# EAGLE design nRF51x22_qfaa (EAGLE 7.6.0)
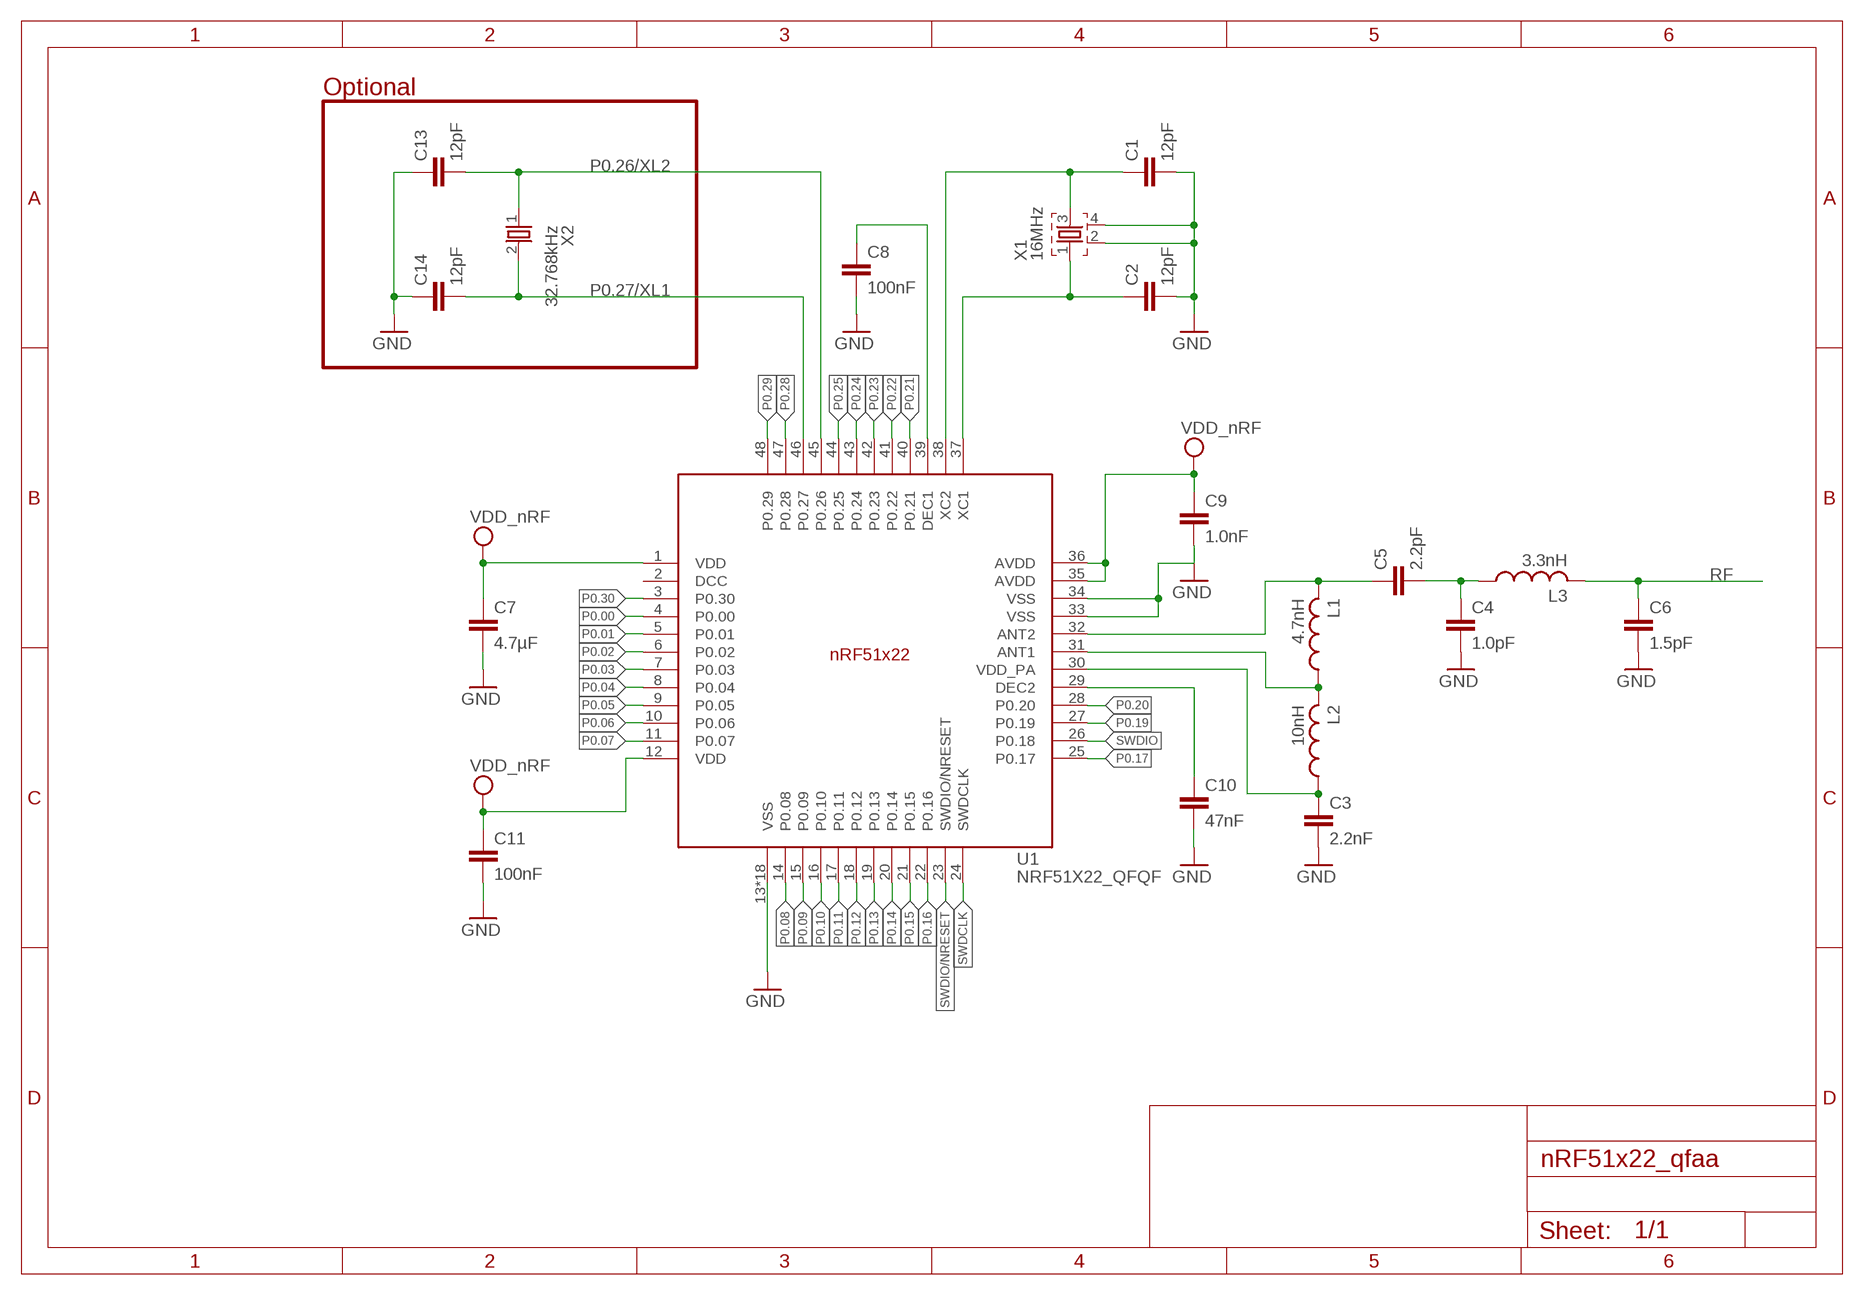
[diagram p0: schematic, sheet 1]

## Parts
C1  12pF  CAPACITOR_0402_N  [RESC0402_N]
C2  12pF  CAPACITOR_0402_N  [RESC0402_N]
C3  2.2nF  CAPACITOR_0402_N  [RESC0402_N]
C4  1.0pF  CAPACITOR_0402_N  [RESC0402_N]
C5  2.2pF  CAPACITOR_0402_N  [RESC0402_N]
C6  1.5pF  CAPACITOR_0402_N  [RESC0402_N]
C7  4.7µF  CAPACITOR_0603_N  [RESC0603_N]
C8  100nF  CAPACITOR_0402_N  [RESC0402_N]
C9  1.0nF  CAPACITOR_0402_N  [RESC0402_N]
C10  47nF  CAPACITOR_0402_N  [RESC0402_N]
C11  100nF  CAPACITOR_0402_N  [RESC0402_N]
C13  12pF  CAPACITOR_0402_N  [RESC0402_N]
C14  12pF  CAPACITOR_0402_N  [RESC0402_N]
L1  4.7nH  INDUCTOR_0402_N  [RESC0402_N]
L2  10nH  INDUCTOR_0402_N  [RESC0402_N]
L3  3.3nH  INDUCTOR_0402_N  [RESC0402_N]
U1  NRF51X22_QFQF  [QFN40P600X600X90-48_N]
X1  16MHz  XTAL_32MHZ  [BT-XTAL_2016_N]
X2  32.768kHz  XTAL_32KHZ  [XTAL_3215_N]

## Nets
GND: C1.2 C2.2 C3.2 C4.2 C6.2 C7.2 C8.2 C9.2 C10.2 C11.2 C13.1 C14.1 U1.13(VSS) U1.33(VSS) U1.34(VSS) U1.PAD(VSS) U1.PAD@VIA01(VSS) U1.PAD@VIA02(VSS) U1.PAD@VIA03(VSS) U1.PAD@VIA04(VSS) U1.PAD@VIA05(VSS) U1.PAD@VIA06(VSS) U1.PAD@VIA07(VSS) U1.PAD@VIA08(VSS) U1.PAD@VIA09(VSS) U1.PAD@VIA10(VSS) U1.PAD@VIA11(VSS) U1.PAD@VIA12(VSS) U1.PAD@VIA13(VSS) U1.PAD@VIA14(VSS) U1.PAD@VIA15(VSS) U1.PAD@VIA16(VSS) X1.2 X1.4
N$1: L1.1 L2.2 U1.31(ANT1)
N$3: C1.1 U1.38(XC2) X1.3
N$5: C10.1 U1.29(DEC2)
N$6: C8.1 U1.39(DEC1)
N$7: C3.1 L2.1 U1.30(VDD_PA)
N$9: C5.1 L1.2 U1.32(ANT2)
N$10: C4.1 C5.2 L3.1
P0.00: U1.4(P0.00)
P0.01: U1.5(P0.01)
P0.02: U1.6(P0.02)
P0.03: U1.7(P0.03)
P0.04: U1.8(P0.04)
P0.05: U1.9(P0.05)
P0.06: U1.10(P0.06)
P0.07: U1.11(P0.07)
P0.08: U1.14(P0.08)
P0.09: U1.15(P0.09)
P0.10: U1.16(P0.10)
P0.11: U1.17(P0.11)
P0.12: U1.18(P0.12)
P0.13: U1.19(P0.13)
P0.14: U1.20(P0.14)
P0.15: U1.21(P0.15)
P0.16: U1.22(P0.16)
P0.17: U1.25(P0.17)
P0.19: U1.27(P0.19)
P0.20: U1.28(P0.20)
P0.21: U1.40(P0.21)
P0.22: U1.41(P0.22)
P0.23: U1.42(P0.23)
P0.24: U1.43(P0.24)
P0.25: U1.44(P0.25)
P0.26/XL2: C13.2 U1.45(P0.26) X2.1
P0.27/XL1: C14.2 U1.46(P0.27) X2.2
P0.28: U1.47(P0.28)
P0.29: U1.48(P0.29)
P0.30: U1.3(P0.30)
RF: C6.1 L3.2
SWDCLK: U1.24(SWDCLK)
SWDIO: U1.26(P0.18)
SWDIO/NRESET: U1.23(SWDIO/NRESET)
VDD_NRF: C7.1 C9.1 C11.1 U1.1(VDD) U1.12(VDD) U1.35(AVDD) U1.36(AVDD) ; supply symbol labelled VDD_nRF
X1: C2.1 U1.37(XC1) X1.1

## Notes on the sheet
- Optional

## Power pins joined to a net without a drawn wire
DCC: U1.2(DCC)

## Library data of the parts
C1-C11 C13 C14 = Nordic_nRF:CAPACITOR: Generic chip capacitor
L1-L3 = Nordic_nRF:INDUCTOR: Generic chip inductor
U1 = Nordic_nRF:NRF51X22_QF: nRF51x22 For devices: nRF51422 nRF51822 Features Single chip, highly flexible, 2.4 GHz multi-protocol device 32-bit ARM Cortex M0 CPU core 256kB/128kB flash + 32kB/16kB RAM Supports Bluetooth low energy protocol stacks Thread safe and run-time protected Event driven API On air compatible with nRF24L series 3 data rates (2Mbps/1Mbps/250kbps) +4dBm output power -93dBm sensitivity, Bluetooth low energy PPI system for maximum power-efficient applications and code simplification Flexible power management system with automatic power management of each peripheral Configurable I/O mapping for analog and digital I/O Applications Mobile phone accessories Wearables Beacons Rezence wireless charging monitoring PC peripherals Consumer Electronics (CE) remote controls Proximity/Alert sensors Smart Home Sports, fitness and healthcare sensors Smart RF tags Toys and electronic games Intelligent domestic appliances Industrial and commercial sensors Lighting
X1 = Nordic_nRF:XTAL_32MHZ
X2 = Nordic_nRF:XTAL_32KHZ

## Board
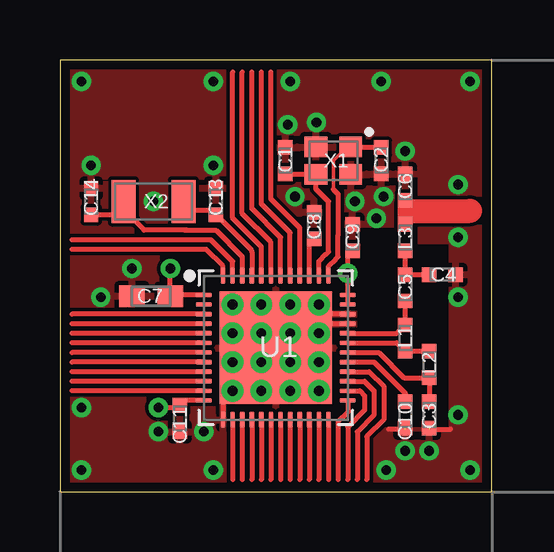
[diagram p1: board, top side]
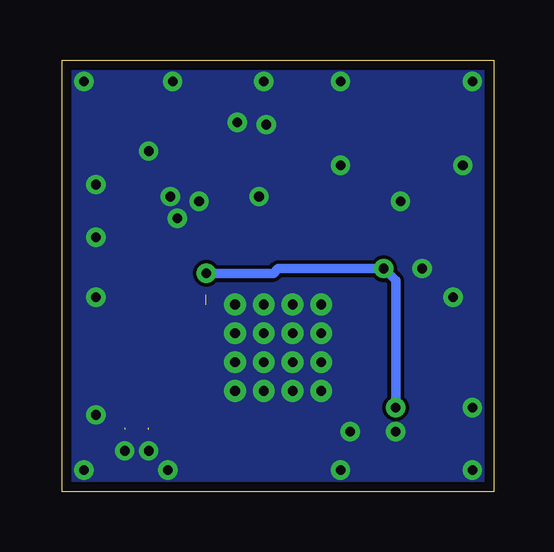
[diagram p2: board, bottom side, seen from below]

Size 18 x 18 mm. Coordinates in mm from the lower left corner, seen from the top.
Outline: 0,0 18,0 18,18 0,18 0,0
Copper layers (1*16): Top 0.035mm / dielectric 1.5mm / Bottom 0.035mm
Design rules "Nordic": minimum track width 0.15mm, minimum drill 0.4mm, track to track 0.15mm, track to pad 0.15mm, pad to pad 0.15mm, via to via 0.15mm, smd to smd 0.15mm, copper to edge 0.4mm, drill to drill 0.4mm, minimum pad ring 10mil, minimum via ring 8mil, stop-mask expansion 4mil, vias tented up to drill 0mil, thermal gap 0.2mm
tRestrict: area 12.4,2.7 to 16.2,10.3; area 11.8,7.2 to 12.2,7.2; area 12.5,10.3 to 14.1,11; area 14.7,12.2 to 14.9,13.1; area 14.7,10.3 to 14.9,11.1

### Footprints (pad centres in the part's own frame; a part is rotated, then mirrored left to right if it is on the bottom)
RESC0402_N = smd 0.6 x 0.6: 1 -0.55,0; 2 0.55,0
RESC0603_N = smd 1.05 x 0.9: 1 -0.8,0; 2 0.8,0
QFN40P600X600X90-48_N = smd 0.65 x 0.2: 1 -3,2.2; 2 -3,1.8; 3 -3,1.4; 4 -3,1; 5 -3,0.6; 6 -3,0.2; 7 -3,-0.2; 8 -3,-0.6; 9 -3,-1; 10 -3,-1.4; 11 -3,-1.8; 12 -3,-2.2; 25 3,-2.2; 26 3,-1.8; 27 3,-1.4; 28 3,-1; 29 3,-0.6; 30 3,-0.2; 31 3,0.2; 32 3,0.6; 33 3,1; 34 3,1.4; 35 3,1.8; 36 3,2.2 | smd 0.2 x 0.65: 13 -2.2,-3; 14 -1.8,-3; 15 -1.4,-3; 16 -1,-3; 17 -0.6,-3; 18 -0.2,-3; 19 0.2,-3; 20 0.6,-3; 21 1,-3; 22 1.4,-3; 23 1.8,-3; 24 2.2,-3; 37 2.2,3; 38 1.8,3; 39 1.4,3; 40 1,3; 41 0.6,3; 42 0.2,3; 43 -0.2,3; 44 -0.6,3; 45 -1,3; 46 -1.4,3; 47 -1.8,3; 48 -2.2,3 | smd 4.7 x 4.7: PAD 0,0 | drill 0.4: PAD@VIA01 -1.8,1.8; PAD@VIA02 -1.8,0.6; PAD@VIA03 -1.8,-0.6; PAD@VIA04 -1.8,-1.8; PAD@VIA05 -0.6,1.8; PAD@VIA06 -0.6,0.6; PAD@VIA07 -0.6,-0.6; PAD@VIA08 -0.6,-1.8; PAD@VIA09 0.6,1.8; PAD@VIA10 0.6,0.6; PAD@VIA11 0.6,-0.6; PAD@VIA12 0.6,-1.8; PAD@VIA13 1.8,1.8; PAD@VIA14 1.8,0.6; PAD@VIA15 1.8,-0.6; PAD@VIA16 1.8,-1.8
BT-XTAL_2016_N = smd 0.95 x 0.85: 1 -0.725,-0.575; 2 0.725,-0.575; 3 0.725,0.575; 4 -0.725,0.575
XTAL_3215_N = smd 1 x 1.8: 1 -1.25,0; 2 1.25,0

### Placement (x,y rotation side)
C1  9.4,13.8 90 top
C2  13.4,13.8 270 top
C3  15.4,3.2 270 top
C4  15.95,9.05 0 top
C5  14.4,8.5 90 top
C6  14.4,12.7 90 top
C7  3.8,8.15 180 top
C8  10.6,11.1 90 top
C9  12.2,10.6 90 top
C10  14.4,3.2 270 top
C11  5,3.05 270 top
C13  6.5,12.1 270 top
C14  1.3,12.1 270 top
L1  14.4,6.4 90 top
L2  15.4,5.3 90 top
L3  14.4,10.6 90 top
U1  9,6 0 top
X1  11.4,13.8 180 top
X2  3.9,12.1 180 top

### Tracks (layer width: path | path; a pad name or v marks a point on that pad's centre or on a via)
GND  (via drill 0.4 pad 0.8)  (2 unrouted)
  Top 0.2: U1.PAD@VIA04 6.8,4.2 U1.13 | U1.34 10.8,7.4 U1.PAD@VIA13 | U1.33 11.2,7 U1.PAD@VIA14 | U1.PAD@VIA04 U1.PAD@VIA16 U1.PAD@VIA13 | U1.PAD@VIA04 U1.PAD@VIA01 U1.PAD@VIA13 | U1.PAD@VIA06 9,6.6 U1.PAD | 14.4,2.6 13.7,2.6 | 15.4,2.6 16.3,2.6
  other vias: 13.5,12.3 12.3,12.1 9.8,12.3 14.4,14.2 16.6,12.8 16.6,10.6 10.7,15.4 9.5,15.3 6.4,13.6 1.3,13.6 6,2.5 4.1,2.5 14.4,1.7 15.4,1.7 16.6,8.1 16.6,3.2 6.4,0.9 0.9,0.9 0.9,3.5 3.9,12.1 9.6,17.1 13.4,17.1 17.1,17.1 17.1,0.9 13.6,0.9 13.2,11.4 0.9,17.1 6.4,17.1 1.7,8.1 3,9.3
  pour Top: 0,0 0,18 18,18 18,0
  pour Bottom: 0,0 0,18 18,18 18,0
  cutout Top: 6.8,3.8 6.8,8.2 11.2,8.2 11.2,3.8
N$1
  Top 0.2: U1.31 14.05,6.2 L1.1 L2.2
N$3
  Top 0.2: U1.38 10.8,9.6 11.1,9.9 11.2,10 11.2,12.1 10.68,12.62 X1.3 10.65,13.25 C1.1
N$5
  Top 0.2: U1.29 13.1,5.4 14.4,4.1 C10.1
N$6
  Top 0.2: U1.39 10.4,10.35 C8.1
N$7
  Top 0.2: C3.1 L2.1 14.35,4.75 13.3,5.8 13,5.8 U1.30
N$9
  Top 0.2: U1.32 14.05,6.6 L1.2 C5.1
N$10
  Top 0.2: C4.1 C5.2 L3.1
P0.00
  Top 0.2: U1.4 0.5,7
P0.01
  Top 0.2: U1.5 0.5,6.6
P0.02
  Top 0.2: U1.6 0.5,6.2
P0.03
  Top 0.2: U1.7 0.5,5.8
P0.04
  Top 0.2: U1.8 0.5,5.4
P0.05
  Top 0.2: U1.9 0.5,5
P0.06
  Top 0.2: U1.10 0.5,4.6
P0.07
  Top 0.2: U1.11 0.5,4.2
P0.08
  Top 0.2: U1.14 7.2,0.5
P0.09
  Top 0.2: U1.15 7.6,0.5
P0.10
  Top 0.2: U1.16 8,0.5
P0.11
  Top 0.2: U1.17 8.4,0.5
P0.12
  Top 0.2: U1.18 8.8,0.5
P0.13
  Top 0.2: U1.19 9.2,0.5
P0.14
  Top 0.2: U1.20 9.6,0.5
P0.15
  Top 0.2: U1.21 10,0.5
P0.16
  Top 0.2: U1.22 10.4,0.5
P0.17
  Top 0.2: U1.25 12,3.3 11.6,2.9 11.6,0.5
P0.19
  Top 0.2: U1.27 12.7,4.6 13.1,4.2 13.1,3.2 12.4,2.5 12.4,0.5
P0.20
  Top 0.2: U1.28 12.9,5 13.5,4.4 13.5,3 12.8,2.3 12.8,0.5
P0.21
  Top 0.2: U1.40 10,11 8.8,12.2 8.8,17.5
P0.22
  Top 0.2: U1.41 9.6,10.8 8.4,12 8.4,17.5
P0.23
  Top 0.2: U1.42 9.2,10.6 8,11.8 8,17.5
P0.24
  Top 0.2: U1.43 8.8,10.4 7.6,11.6 7.6,17.5
P0.25
  Top 0.2: U1.44 8.4,10.2 7.2,11.4 7.2,17.5
P0.26/XL2
  Top 0.2: X2.1 5.5,11.75 | 5.5,11.75 5.5,11.4 | 5.5,11.75 6.3,11.75 arc-90 C13.2 8,10.05 8,10 U1.45
P0.27/XL1
  Top 0.2: 2.65,11.75 3.5,10.9 5.2,10.9 5.3,10.9 6.5,10.9 7.6,9.8 U1.46 | 2.65,11.75 X2.2 2.65,11.75 | C14.2 2.65,11.55 2.65,11.75
P0.28
  Top 0.2: U1.47 7.2,9.6 6.3,10.5 0.5,10.5
P0.29
  Top 0.2: U1.48 6.8,9.4 6.1,10.1 0.5,10.1
P0.30
  Top 0.2: U1.3 0.5,7.4
RF
  Top 0.2: C6.1 14.6,11.7 L3.2 14.25,11.15 14.2,11.2 14.2,12.1
  Top 1: 14.6,11.7 17.1,11.7
SWDCLK
  Top 0.2: U1.24 11.2,0.5
SWDIO
  Top 0.2: U1.26 12.5,4.2 12.7,4 12.7,3.4 12,2.7 12,0.5
SWDIO/NRESET
  Top 0.2: U1.23 10.8,0.5
VDD_NRF  (via drill 0.4 pad 0.8)  (1 unrouted)
  Top 0.2: U1.12 5.1,3.8 C11.1 5,3.5 v4.1,3.5 | U1.35 v12,9.1 12,9.85 C9.1 | U1.1 4.6,8.2 | 4.6,8.2 C7.1 | 4.6,8.2 v4.6,9.3
  Bottom 0.4: v4.1,3.5 4.1,7.8 4.1,8.8 v4.6,9.3 9,9.3 9.2,9.1 v12,9.1
X1
  Top 0.15: X1.1 11.85,14.1 11.7,14.1 11.4,13.8 11.4,12.6
  Top 0.2: U1.37 11.2,9.4 11.5,9.7 11.6,9.8 11.6,10.7 11.6,12.4 11.4,12.6 | C2.1 12.15,14.35 X1.1